# EAGLE design pwr_supply (EAGLE 9.6.2)
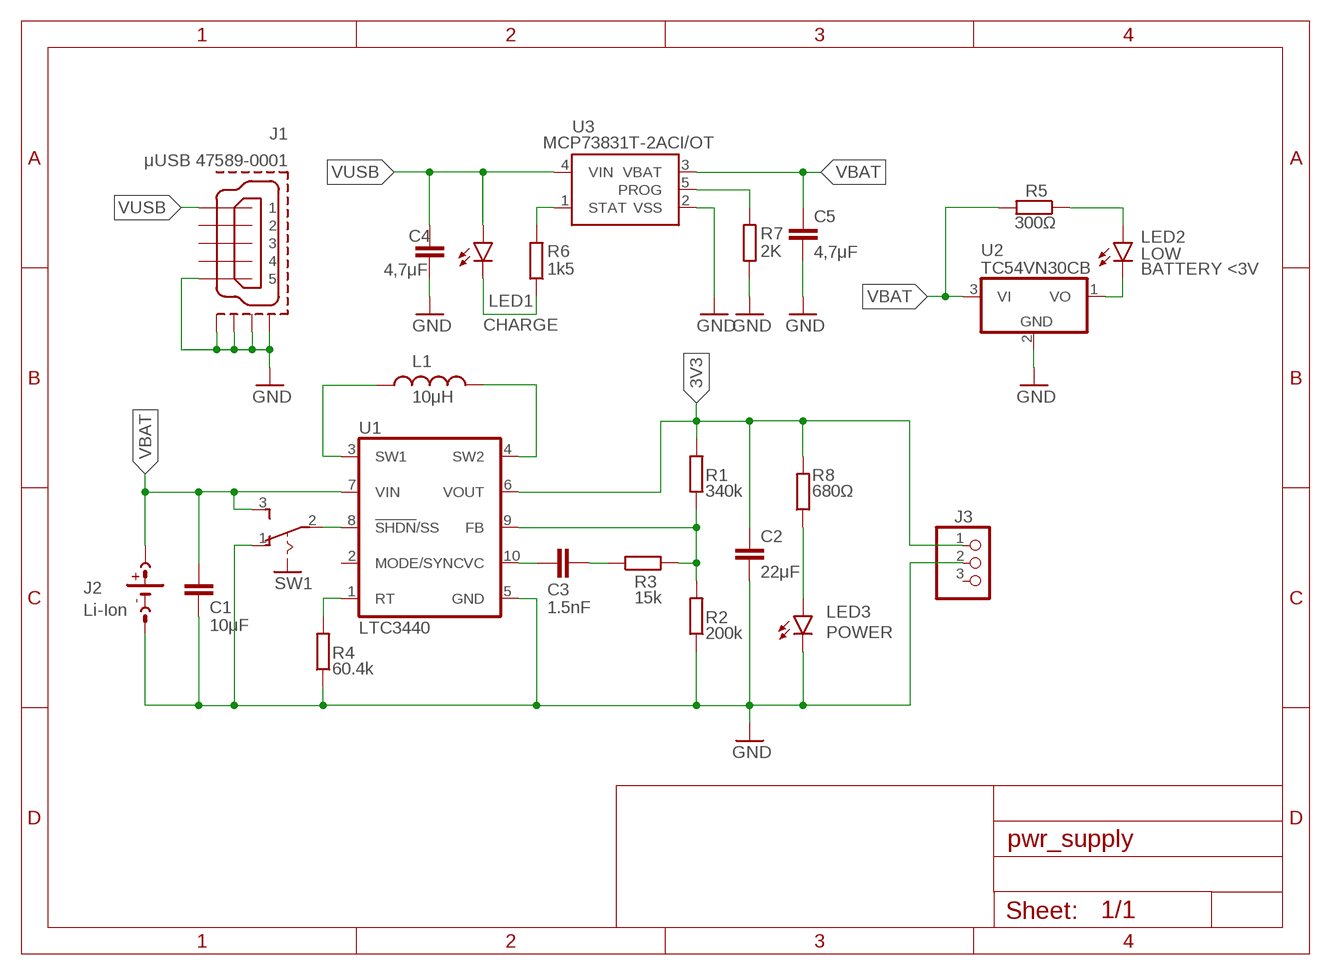
[diagram p0: schematic, sheet 1]

## Parts
C1  10μF  C-EUC0805  [C0805]
C2  22μF  C-EUC1210  [C1210]
C3  1.5nF  C-EUC0805  [C0805]
C4  4,7μF  C-EUC0805  [C0805]
C5  4,7μF  C-EUC0805  [C0805]
J1  μUSB 47589-0001  MICRO-USB-RECEPTACLE47589-0001  [47589-0001]
J2  Li-Ion  LION_3V7_JST2  [JSTPH2]
J3  PINHD-1X3/90  [1X03/90]
L1  10μH  CDRH6D38  [CDRH6D38]
LED1  CHARGE  LEDCHIPLED_0805  [CHIPLED_0805]
LED2  LOW  LEDCHIPLED_0805  [CHIPLED_0805]
LED3  POWER  LEDCHIPLED_0805  [CHIPLED_0805]
R1  340k  R-EU_R0805  [R0805]
R2  200k  R-EU_R0805  [R0805]
R3  15k  R-EU_R0805  [R0805]
R4  60.4k  R-EU_R0805  [R0805]
R5  300Ω  R-EU_R0805  [R0805]
R6  1k5  R-EU_R0805  [R0805]
R7  2K  R-EU_R0805  [R0805]
R8  680Ω  R-EU_R0805  [R0805]
SW1  JS102011SAQN  [JS102011SAQN]
U1  LTC3440  [MSOP10]
U2  TC54VN30CB  TC54VN3002ECB713  [SOT23]
U3  MCP73831T-2ACI/OT  MCP73831  [SOT23-5]

## Nets
3V3: C2.1 J3.1 R1.2 R8.2 U1.6(VOUT)
GND: C1.2 C2.2 C4.2 C5.2 J1.5 J1.CASING1(GND1) J1.CASING2(GND2) J1.CASING3(GND3) J1.CASING4(GND4) J2.1(-) J3.2 LED3.C R2.1 R4.1 R7.1 SW1.1(O) U1.5(GND) U2.2(GND) U3.2(VSS)
N$1: R4.2 U1.1(RT)
N$2: LED2.A R5.1
N$3: L1.1 U1.3(SW1)
N$4: L1.2 U1.4(SW2)
N$5: C3.1 U1.10(VC)
N$6: C3.2 R3.1
N$7: R1.1 R2.2 R3.2 U1.9(FB)
N$8: SW1.2(P) U1.8(!SHDN!/SS)
N$9: LED2.C U2.1(VO)
N$10: R7.2 U3.5(PROG)
N$11: R6.2 U3.1(STAT)
N$12: LED1.C R6.1
N$13: LED3.A R8.1
VBAT: C1.1 C5.1 J2.2(+) R5.2 SW1.3(S) U1.7(VIN) U2.3(VI) U3.3(VBAT)
VUSB: C4.1 J1.1 LED1.A U3.4(VIN)
Unconnected: J1.2 J1.3 J1.4 J3.3 U1.2(MODE/SYNC)

## Notes on the sheet
- BATTERY <3V

## Library data of the parts
C1-C5 = rcl:C-EU: CAPACITOR, European symbol; SPICEPREFIX: C
J1 = con-molex-usb:MICRO-USB-RECEPTACLE: MICRO USB RECEPTACLES Micro-USB Receptacles, SMT, Lead-Free from MOLEX <http://www.molex.com/>. (C) 2014 Tomasz Boleslaw CEDRO, cederom@tlen.pl, http://www.tomek.cedro.info. Version 0.1 (2014-01-17): Initial release. Version 0.2 (2014-02-06): Updated 47589-0001 footprint pins/pads/milling. Following devices are included: 1. 47589-0001 Micro-USB AB Receptacle, Bottom Mount, SMT, Lead-Free <http://www.molex.com/molex/products/datasheet.jsp?part=active/0475890001_IO_CONNECTORS.xml> (Technical Drawing <http://www.molex.com/pdm_docs/sd/475890001_sd.pdf>).
J2 = Saltech-connectors:LION_3V7_JST2
J3 = pinhead:PINHD-1X3: PIN HEADER
L1 = Saltech-passives:CDRH6D38
LED1-LED3 = led:LED: LED OSRAM: - CHIPLED LG R971, LG N971, LY N971, LG Q971, LY Q971, LO R971, LY R971 LH N974, LH R974 LS Q976, LO Q976, LY Q976 LO Q996 - Hyper CHIPLED LW Q18S LB Q993, LB Q99A, LB R99A - SideLED LS A670, LO A670, LY A670, LG A670, LP A670 LB A673, LV A673, LT A673, LW A673 LH A674 LY A675 LS A676, LA A676, LO A676, LY A676, LW A676 LS A679, LY A679, LG A679 - Hyper Micro SIDELED® LS Y876, LA Y876, LO Y876, LY Y876 LT Y87S - SmartLED LW L88C, LW L88S LB L89C, LB L89S, LG L890 LS L89K, LO L89K, LY L89K LS L896, LA L896, LO L896, LY L896 - TOPLED LS T670, LO T670, LY T670, LG T670, LP T670 LSG T670, LSP T670, LSY T670, LOP T670, LYG T670 LG T671, LOG T671, LSG T671 LB T673, LV T673, LT T673, LW T673 LH T674 LS T676, LA T676, LO T676, LY T676, LB T676, LH T676, LSB T676, LW T676 LB T67C, LV T67C, LT T67C, LS T67K, LO T67K, LY T67K, LW E67C LS E67B, LA E67B, LO E67B, LY E67B, LB E67C, LV E67C, LT E67C LW T67C LS T679, LY T679, LG T679 LS T770, LO T770, LY T770, LG T770, LP T770 LB T773, LV T773, LT T773, LW T773 LH T774 LS E675, LA E675, LY E675, LS T675 LS T776, LA T776, LO T776, LY T776, LB T776 LHGB T686 LT T68C, LB T68C - Hyper Mini TOPLED® LB M676 - Mini TOPLED Santana® LG M470 LS M47K, LO M47K, LY M47K Source: http://www.osram.convergy.de LUXEON: - LUMILED® LXK2-PW12-R00, LXK2-PW12-S00, LXK2-PW14-U00, LXK2-PW14-V00 LXK2-PM12-R00, LXK2-PM12-S00, LXK2-PM14-U00 LXK2-PE12-Q00, LXK2-PE12-R00, LXK2-PE12-S00, LXK2-PE14-T00, LXK2-PE14-U00 LXK2-PB12-K00, LXK2-PB12-L00, LXK2-PB12-M00, LXK2-PB14-N00, LXK2-PB14-P00, LXK2-PB14-Q00 LXK2-PR12-L00, LXK2-PR12-M00, LXK2-PR14-Q00, LXK2-PR14-R00 LXK2-PD12-Q00, LXK2-PD12-R00, LXK2-PD12-S00 LXK2-PH12-R00, LXK2-PH12-S00 LXK2-PL12-P00, LXK2-PL12-Q00, LXK2-PL12-R00 Source: www.luxeon.com KINGBRIGHT: KA-3528ASYC Source: www.kingbright.com
R1-R8 = rcl:R-EU_: RESISTOR, European symbol; SPICEPREFIX: R
SW1 = Saltech-switches:JS102011SAQN
U1 = Saltech-ics:LTC3440
U2 = Saltech-ics:TC54VN3002
U3 = SparkFun-IC-Power:MCP73831: MCP73831T Li-Ion, Li-Pol Controller Miniature single cell, fully integrated Li-Ion, Li-polymer charge management controller Datasheet <http://ww1.microchip.com/downloads/en/DeviceDoc/20001984g.pdf> SparkFun Products: SparkFun ESP32 Thing <https://www.sparkfun.com/products/13907> SparkFun 9DoF Razor IMU M0 <https://www.sparkfun.com/products/14001>; PROD_ID: IC-09995

## Board
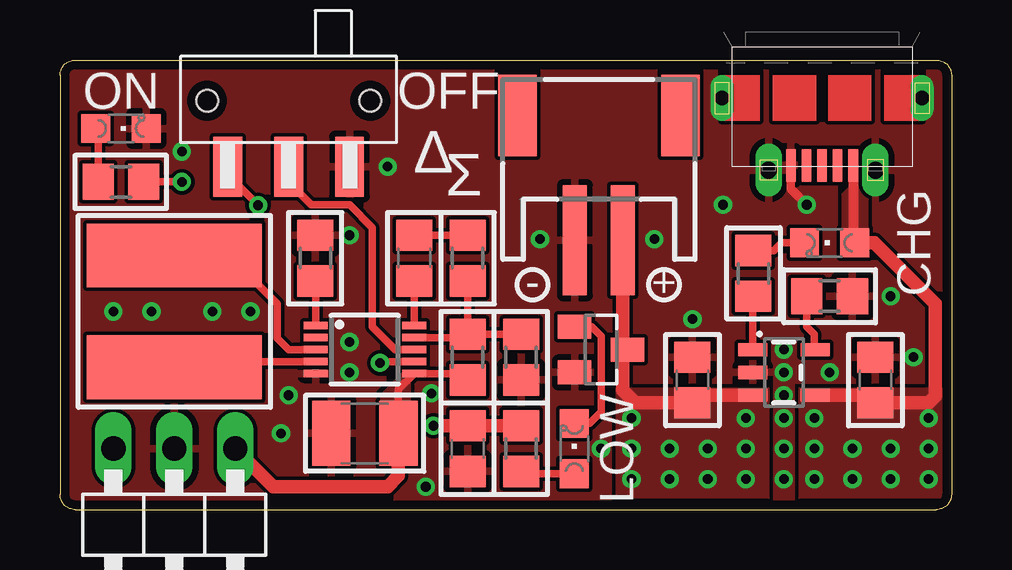
[diagram p1: board, top side]
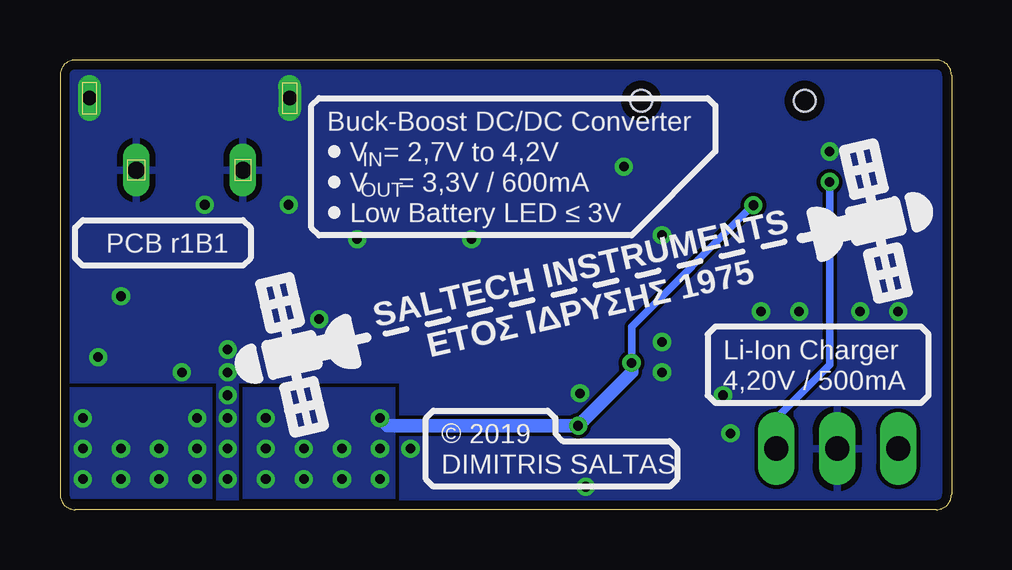
[diagram p2: board, bottom side, seen from below]

Size 37.15 x 18.73 mm. Coordinates in mm from the lower left corner, seen from the top.
Outline: 0.64,0 36.51,0 arc90 37.15,0.64 37.15,18.1 arc90 36.51,18.73 0.64,18.73 arc90 0,18.1 0,0.64 arc90 0.64,0
Copper layers (1*16): Top 0.0356mm / dielectric 1.5011mm / Bottom 0.0356mm
Design rules "oshpark-2layer *": minimum track width 6mil, minimum drill 13mil, track to track 6mil, track to pad 6mil, pad to pad 6mil, via to via 6mil, smd to smd 6mil, copper to edge 15mil, drill to drill 6mil, minimum pad ring 7mil, minimum via ring 7mil, stop-mask expansion 2.5mil, vias tented up to drill 18mil, thermal gap 10mil

### Footprints (pad centres in the part's own frame; a part is rotated, then mirrored left to right if it is on the bottom)
C0805 = smd 1.3 x 1.5: 1 -0.95,0; 2 0.95,0
C1210 = smd 1.6 x 2.7: 1 -1.4,0; 2 1.4,0
47589-0001 = smd 1.35 x 0.4: 1 2.8,1.3; 2 2.8,0.65; 3 2.8,0; 4 2.8,-0.65; 5 2.8,-1.3 | drill 0.6 pad 0.95 long: CASING1 0,4.175; CASING2 0,-4.175 | drill 0.7 pad 1.1 long: CASING3 3,2.225; CASING4 3,-2.225
JSTPH2 = smd 1 x 4.6: 1 -1.088,-3.7; 2 0.912,-3.7 | smd 1.6 x 3.4: NC1 -3.488,1.5; NC2 3.312,1.5
1X03/90 = drill 1.016 long: 1 -2.54,-3.81; 2 0,-3.81; 3 2.54,-3.81
CDRH6D38 = smd 2.65 x 7.3: 1 -2.325,0; 2 2.325,0
CHIPLED_0805 = smd 1.2 x 1.2: A 0,-1.05; C 0,1.05
R0805 = smd 1.3 x 1.5: 1 -0.95,0; 2 0.95,0
JS102011SAQN = smd 1.2 x 2.5: 1 -2.54,0; 2 0,0; 3 2.54,0 | hole 0.9: -3.4,-2.75; 3.4,-2.75
MSOP10 = smd 0.3 x 1: 1 -1,-2.05; 2 -0.5,-2.05; 3 0,-2.05; 4 0.5,-2.05; 5 1,-2.05; 6 1,2.05; 7 0.5,2.05; 8 0,2.05; 9 -0.5,2.05; 10 -1,2.05
SOT23 = smd 1 x 1.4: 1 -0.95,-1.1; 2 0.95,-1.1; 3 0,1.1
SOT23-5 = smd 0.55 x 1.2: 1 -0.95,-1.3; 2 0,-1.3; 3 0.95,-1.3; 4 0.95,1.3; 5 -0.95,1.3

### Placement (x,y rotation side)
C1  16.99,2.54 270 top
C2  12.7,3.17 180 top
C3  14.76,10.48 90 top
C4  33.97,5.4 90 top
C5  26.35,5.4 90 top
J1  31.75,17.14 270 top
J2  22.54,14.92 0 top
J3  4.76,-1.27 180 top
L1  4.76,8.26 270 top
LED1  32.07,11.11 90 top
LED2  21.43,2.54 0 top
LED3  2.54,15.88 270 top
R1  16.99,6.35 270 top
R2  19.21,6.35 90 top
R3  16.99,10.48 270 top
R4  10.64,10.48 270 top
R5  19.21,2.54 90 top
R6  28.89,9.84 270 top
R7  32.07,8.89 180 top
R8  2.54,13.65 0 top
SW1  9.53,14.29 180 top
U1  12.7,6.67 270 top
U2  22.54,6.67 270 top
U3  30.16,5.71 270 top

### Tracks (layer width: path | path; a pad name or v marks a point on that pad's centre or on a via)
3V3  (via drill 0.4)
  Top 0.305: v5.08,13.65 R8.2 | R1.2 16.72,5.67 U1.6 14.1,5.02 C2.1
  Top 0.559: C2.1 14.1,1.4 13.65,0.95 8.89,0.95 J3.1
  Bottom 0.305: J3.1 7.3,3.81 5.08,6.03 v5.08,13.65
  pour Top (no thermals): 14.61,5.71 14.29,5.71 13.34,4.76 13.34,4.45 14.61,4.45
GND  (via drill 0.4)
  Top 0.305: R2.1 19.53,5.72
  Top 0.356: J1.5 30.45,13.37 v31.11,12.7
  other vias: 15.48,4.84 30.16,5.71 30.16,1.27 30.16,2.54 30.16,3.81 32.07,5.71 26.35,7.94 34.61,8.89 35.56,6.35 15.24,0.95 9.21,3.17 13.65,14.29 20,11.27 24.77,11.27 22.54,2.54 12.06,5.71 12.06,11.43 5.08,14.92 2.22,8.26 3.81,8.26 6.35,8.26 7.94,8.26 27.62,12.7 9.53,4.76 30.16,6.67 30.16,4.76 12.06,6.99
  pour Top (rank 2): 0,18.73 37.15,18.73 37.15,0 0,0
  pour Bottom (rank 6): 0,18.73 37.15,18.73 37.15,0 0,0
N$1
  Top 0.305: U1.1 10.65,9.51 R4.2
N$2
  Top 0.305: LED2.A 19.31,1.49 R5.1
N$3
  Top 0.305: L1.1 7.04,10.58 9.05,8.57 9.05,7.14 9.53,6.67 U1.3
N$4
  Top 0.305: U1.4 5,6.17 L1.2
N$5
  Top 0.305: U1.10 14.75,9.51 C3.1
N$6
  Top 0.305: R3.1 C3.2
N$7
  Top 0.305: R1.1 R3.2 | R2.2 R1.1 | R1.1 16.85,7.17 U1.9
N$8
  Top 0.305: U1.8 13.97,6.67 13.02,7.62 13.02,11.75 12.06,12.7 10.48,12.7 9.53,13.65 SW1.2
N$9
  Top 0.305: U2.1 22.15,7.62 22.54,7.22 22.54,4.07 22.07,3.59 LED2.C
N$10
  Top 0.305: U3.5 31.43,6.7 31.43,7.3 31.11,7.62 R7.2
N$11
  Top 0.305: U3.1 28.86,8.86 R6.2
N$12
  Top 0.305: LED1.C 30.07,11.11 29.75,10.79 R6.1
N$13
  Top 0.305: LED3.A 1.59,15.78 R8.1
VBAT  (via drill 0.4)
  Top 0.305: U1.7 13.39,6.17 v13.34,6.11 | v8.26,12.68 6.99,13.95 SW1.3
  Top 0.559: J2.2 23.45,6.86 | 23.45,6.86 U2.3 | C5.1 23.97,4.45 23.45,4.96 23.45,6.86 | U3.3 26.67,4.76 C5.1 | v15.56,3.49 C1.1 R5.2
  Top 0.762: C5.1
  Bottom 0.305: v13.34,6.11 13.34,7.62 8.27,12.68 v8.26,12.68
  Bottom 0.559: v23.81,3.81 23.5,3.49 v15.56,3.49 13.34,5.71 v13.34,6.11
  other vias: 28.57,2.54 28.57,3.81 28.57,1.27 26.99,1.27 26.99,2.54 25.4,2.54 25.4,1.27 23.81,1.27 23.81,2.54
  pour Top (no thermals): 23.18,5.08 29.53,5.08 29.53,0.48 23.18,0.48
  pour Bottom: 23.18,5.08 29.53,5.08 29.53,0.48 23.18,0.48
VUSB  (via drill 0.4)
  Top 0.305: C4.1
  Top 0.406: J1.1 33.05,11.18 LED1.A
  Top 0.559: U3.4 33.66,4.76 C4.1 36.2,4.45 36.48,4.72 36.48,8.57 33.94,11.11 LED1.A
  other vias: 36.2,2.54 31.43,1.27 31.43,2.54 31.43,3.81 33.02,2.54 33.02,1.27 34.61,2.54 34.61,1.27 36.2,1.27 36.2,3.81
  pour Top (no thermals): 30.8,5.08 36.99,5.08 36.99,0.48 30.8,0.48
  pour Bottom: 30.8,5.08 36.99,5.08 36.99,0.48 30.8,0.48
  pour Top (no thermals): 33.06,13.63 32.56,13.13 32.56,11.43 33.68,11.43 33.68,13.02

### Text on the board
tPlace: ON | OFF | Δ | Σ | CHG | - | + | LOW
bPlace: Buck-Boost DC/DC Converter | IN | V = 2,7V to 4,2V | V = 3,3V / 600mA | OUT | Low Battery LED ≤ 3V | PCB r1B1 | SALTECH INSTRUMENTS / ETOΣ IΔPYΣHΣ 1975 | Li-Ion Charger | 4,20V / 500mA | © 2019 | DIMITRIS SALTAS
Reference: SW1 | J1 | LED3 | J2 | R8 | LED1 | R4 | C3 | R3 | R6 | R7 | L1 | U1 | U2 | R1 | R2 | U3 | C5 | C4 | C2 | C1 | R5 | LED2